# EAGLE schematic anbisonique (EAGLE 7.6.0)
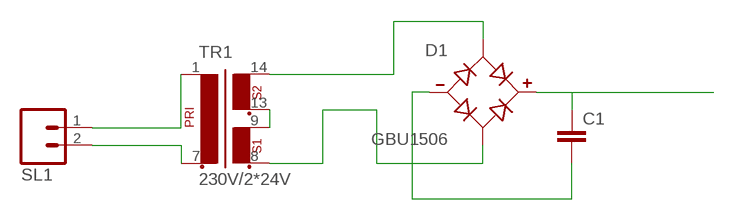
[diagram p0: schematic, sheet 1]

## Parts
C1  C-EUC0603  [C0603]
D1  GBU1506  [SIP343W114P508L2205H2134Q4]
SL1  M02  [02P]
TR1  230V/2*24V  EI60-2  [EI60-2]

## Nets
N$1: TR1.9 TR1.13
N$2: D1.AC1 TR1.14
N$4: SL1.1 TR1.1
N$5: SL1.2 TR1.7
N$6: D1.AC2 TR1.8
N$7: C1.2 D1.-
N$8: C1.1 D1.+

## Library data of the parts
C1 = rcl:C-EU: CAPACITOR, European symbol
D1 = GBU1506:GBU1506: Check availability <https://pricing.snapeda.com/parts/GBU1506/Taiwan%20Semiconductor%20Corporation/view-part?ref=eda>; AVAILABILITY: In Stock; DESCRIPTION: 15A, 800V, Standard Bridge Rectifier; MF: Taiwan Semiconductor Corporation; MP: GBU1506; PACKAGE: GBU Taiwan Semiconductor; PRICE: None
SL1 = con-amp-quick:M02: AMP QUICK CONNECTOR; OC_FARNELL: unknown; OC_NEWARK: unknown
TR1 = trafo:EI60-2: TRANSFORMER 1 primary winding, 2 secondary windings, mounting holes ERA